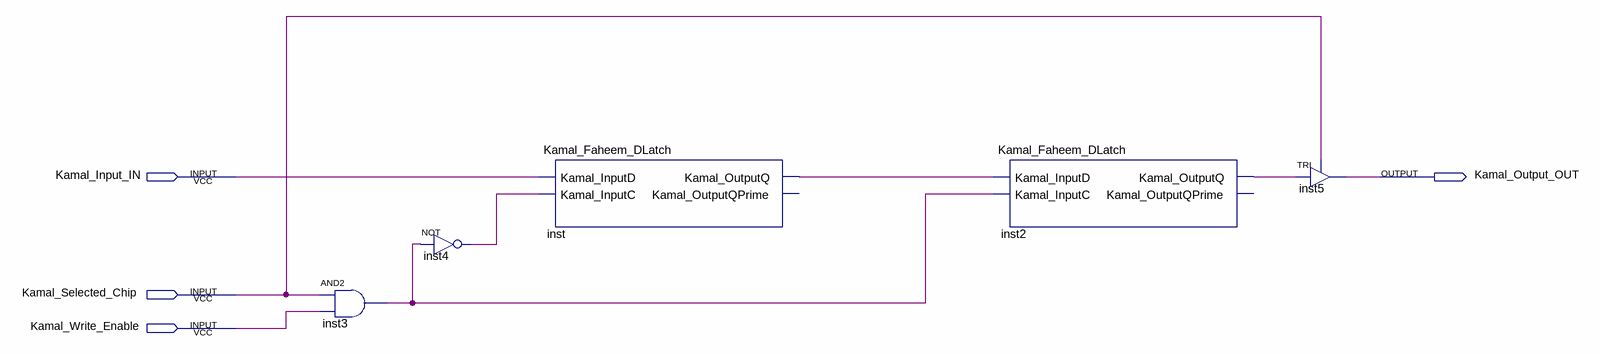
[diagram p0: schematic sheet]
// Quartus schematic Kamal_Faheem_SRAM.bdf as structural Verilog: 5 symbols, 4 pins
module Kamal_Faheem_SRAM (
  input  Kamal_Input_IN,
  input  Kamal_Selected_Chip,
  input  Kamal_Write_Enable,
  output Kamal_Output_OUT
);

  wire inst2_kamal_outputq, inst3_out, inst4_out, inst_kamal_outputq;

  and inst3 (inst3_out, Kamal_Selected_Chip, Kamal_Write_Enable);
  not inst4 (inst4_out, inst3_out);
  Kamal_Faheem_DLatch inst (
    .Kamal_InputD(Kamal_Input_IN), .Kamal_InputC(inst4_out), .Kamal_OutputQ(inst_kamal_outputq));  // open: Kamal_OutputQPrime
  Kamal_Faheem_DLatch inst2 (
    .Kamal_InputD(inst_kamal_outputq), .Kamal_InputC(inst3_out), .Kamal_OutputQ(inst2_kamal_outputq));  // open: Kamal_OutputQPrime
  TRI inst5 (.IN(inst2_kamal_outputq), .OE(Kamal_Selected_Chip), .OUT(Kamal_Output_OUT));
endmodule
